# Altium schematic sheet Main.SchDoc
size A4; Address1: Unska 3; Address2: 10000; Address3: Zagreb; SheetNumber: 1; DocumentName: Main; ProjectName: Main
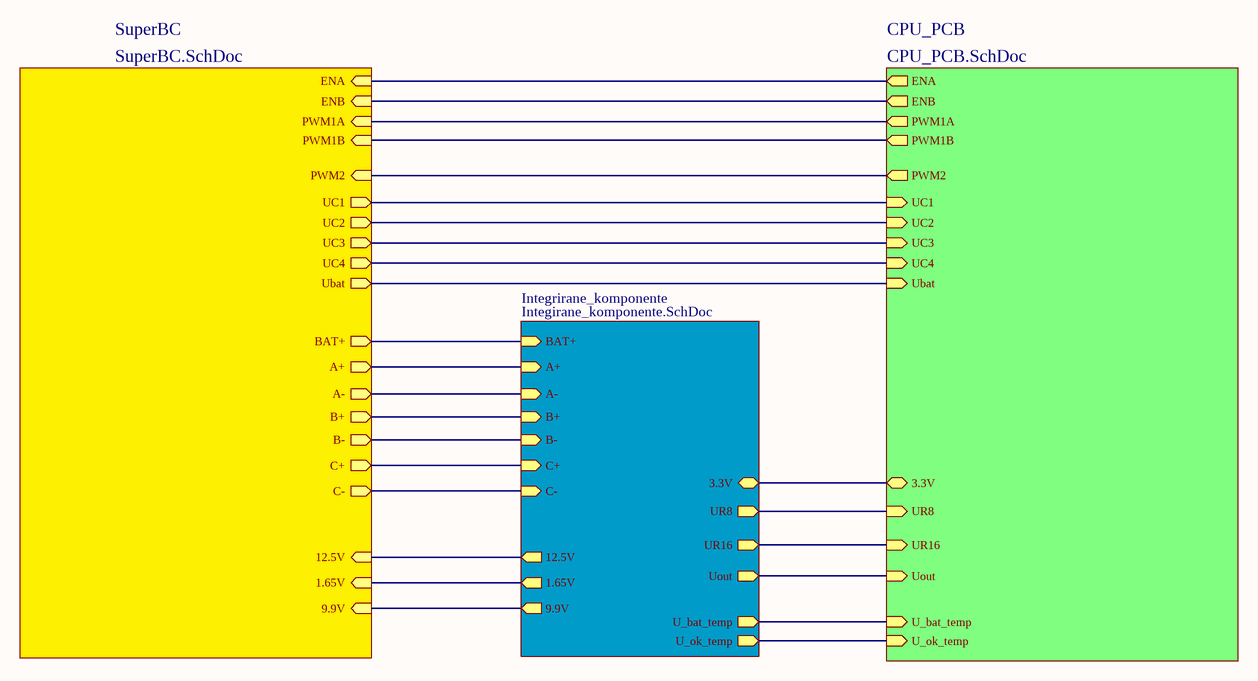
[diagram p0: Main.SchDoc]

## Sub-sheets
CPU_PCB = CPU_PCB.SchDoc: PWM1A (out), PWM2 (out), UC1 (in), UC2 (in), UC3 (in), UC4 (in), Ubat (in), UR8 (in), UR16 (in), Uout (in), 3.3V, U_bat_temp (in), U_ok_temp (in), PWM1B (out), ENA (out), ENB (out)
Integrirane_komponente = Integirane_komponente.SchDoc: BAT+ (in), A+ (in), A- (in), B+ (in), B- (in), C+ (in), C- (in), 12.5V (out), 1.65V (out), 9.9V (out), UR8 (out), UR16 (out), Uout (out), 3.3V, U_bat_temp (out), U_ok_temp (out)
SuperBC = SuperBC.SchDoc: PWM1A (in), PWM2 (in), UC1 (out), UC2 (out), UC3 (out), UC4 (out), Ubat (out), BAT+ (out), A+ (out), A- (out), B+ (out), B- (out), C+ (out), C- (out), 12.5V (in), 1.65V (in), 9.9V (in), PWM1B (in), ENB (in), ENA (in)

## Nets
(unnamed): sheet CPU_PCB/PWM1A, sheet SuperBC/PWM1A
(unnamed): sheet CPU_PCB/PWM2, sheet SuperBC/PWM2
(unnamed): sheet CPU_PCB/UC1, sheet SuperBC/UC1
(unnamed): sheet CPU_PCB/UC2, sheet SuperBC/UC2
(unnamed): sheet CPU_PCB/UC3, sheet SuperBC/UC3
(unnamed): sheet CPU_PCB/UC4, sheet SuperBC/UC4
(unnamed): sheet CPU_PCB/Ubat, sheet SuperBC/Ubat
(unnamed): sheet CPU_PCB/UR8, sheet Integrirane_komponente/UR8
(unnamed): sheet CPU_PCB/UR16, sheet Integrirane_komponente/UR16
(unnamed): sheet CPU_PCB/Uout, sheet Integrirane_komponente/Uout
(unnamed): sheet CPU_PCB/3.3V, sheet Integrirane_komponente/3.3V
(unnamed): sheet CPU_PCB/U_bat_temp, sheet Integrirane_komponente/U_bat_temp
(unnamed): sheet CPU_PCB/U_ok_temp, sheet Integrirane_komponente/U_ok_temp
(unnamed): sheet CPU_PCB/PWM1B, sheet SuperBC/PWM1B
(unnamed): sheet CPU_PCB/ENA, sheet SuperBC/ENA
(unnamed): sheet CPU_PCB/ENB, sheet SuperBC/ENB
(unnamed): sheet SuperBC/BAT+, sheet Integrirane_komponente/BAT+
(unnamed): sheet SuperBC/A+, sheet Integrirane_komponente/A+
(unnamed): sheet SuperBC/A-, sheet Integrirane_komponente/A-
(unnamed): sheet SuperBC/B+, sheet Integrirane_komponente/B+
(unnamed): sheet SuperBC/B-, sheet Integrirane_komponente/B-
(unnamed): sheet SuperBC/C+, sheet Integrirane_komponente/C+
(unnamed): sheet SuperBC/C-, sheet Integrirane_komponente/C-
(unnamed): sheet SuperBC/12.5V, sheet Integrirane_komponente/12.5V
(unnamed): sheet SuperBC/1.65V, sheet Integrirane_komponente/1.65V
(unnamed): sheet SuperBC/9.9V, sheet Integrirane_komponente/9.9V